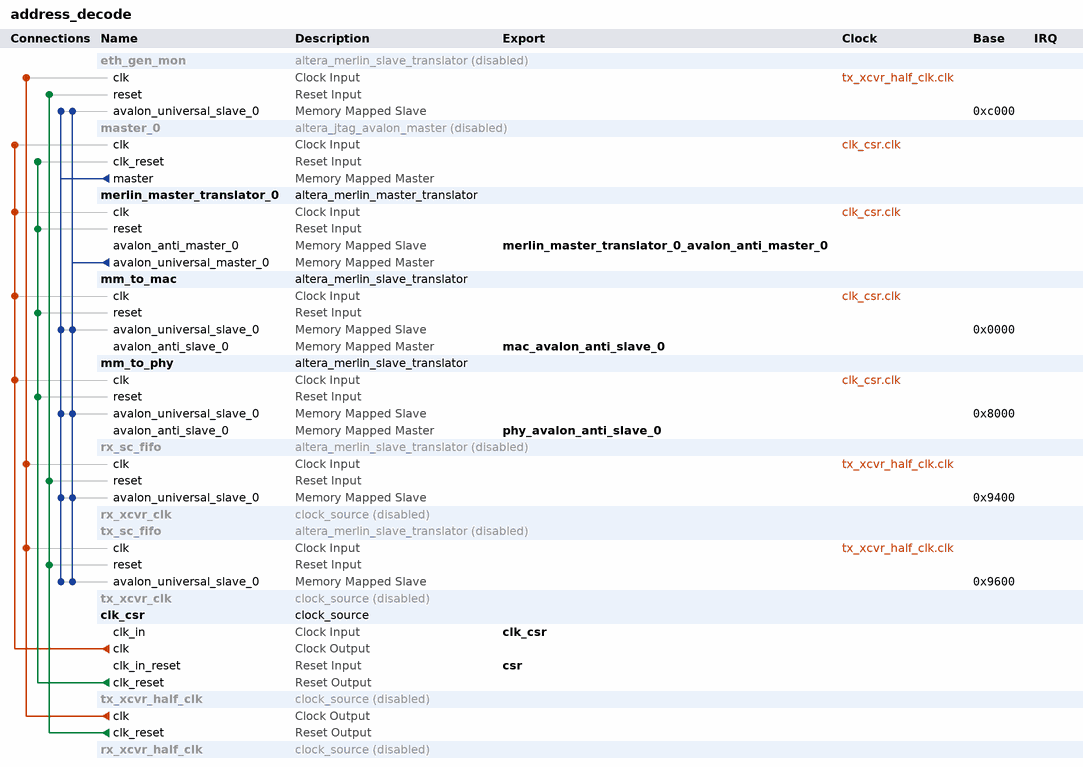
[diagram p0: system contents]
# Platform Designer (Qsys) system address_decode, Stratix 10 1SG280LU2F50E1VG
# Parameters at their usual value, and those the tool derives, are not listed.
package require -exact qsys 1.0
create_system address_decode
set_project_property DEVICE_FAMILY {Stratix 10}
set_project_property DEVICE 1SG280LU2F50E1VG

add_component eth_gen_mon ip/address_decode/address_decode_eth_gen_mon.ip altera_merlin_slave_translator eth_gen_mon 16.1
set_instance_property eth_gen_mon ENABLED false

add_component master_0 {} altera_jtag_avalon_master master_0 16.1
set_instance_property master_0 ENABLED false

add_component merlin_master_translator_0 ip/address_decode/address_decode_merlin_master_translator_0.ip altera_merlin_master_translator merlin_master_translator_0 16.1

add_component mm_to_mac ip/address_decode/address_decode_mm_to_mac.ip altera_merlin_slave_translator mm_to_mac 16.1

add_component mm_to_phy ip/address_decode/address_decode_mm_to_phy.ip altera_merlin_slave_translator mm_to_phy 16.1

add_component rx_sc_fifo ip/address_decode/address_decode_rx_sc_fifo.ip altera_merlin_slave_translator rx_sc_fifo 16.1
set_instance_property rx_sc_fifo ENABLED false

add_component rx_xcvr_clk ip/address_decode/address_decode_rx_xcvr_clk.ip clock_source rx_xcvr_clk 
set_instance_property rx_xcvr_clk ENABLED false

add_component tx_sc_fifo ip/address_decode/address_decode_tx_sc_fifo.ip altera_merlin_slave_translator tx_sc_fifo 16.1
set_instance_property tx_sc_fifo ENABLED false

add_component tx_xcvr_clk ip/address_decode/address_decode_tx_xcvr_clk.ip clock_source tx_xcvr_clk 
set_instance_property tx_xcvr_clk ENABLED false

add_component clk_csr ip/address_decode/address_decode_clk_csr.ip clock_source clk_csr 

add_component tx_xcvr_half_clk ip/address_decode/address_decode_tx_xcvr_half_clk.ip clock_source tx_xcvr_half_clk 
set_instance_property tx_xcvr_half_clk ENABLED false

add_component rx_xcvr_half_clk ip/address_decode/address_decode_rx_xcvr_half_clk.ip clock_source rx_xcvr_half_clk 
set_instance_property rx_xcvr_half_clk ENABLED false

# connections
add_connection clk_csr.clk master_0.clk clock
add_connection clk_csr.clk merlin_master_translator_0.clk clock
add_connection clk_csr.clk mm_to_mac.clk clock
add_connection clk_csr.clk mm_to_phy.clk clock
add_connection tx_xcvr_half_clk.clk eth_gen_mon.clk clock
add_connection tx_xcvr_half_clk.clk rx_sc_fifo.clk clock
add_connection tx_xcvr_half_clk.clk tx_sc_fifo.clk clock
add_connection clk_csr.clk_reset master_0.clk_reset reset
add_connection clk_csr.clk_reset merlin_master_translator_0.reset reset
add_connection clk_csr.clk_reset mm_to_mac.reset reset
add_connection clk_csr.clk_reset mm_to_phy.reset reset
add_connection tx_xcvr_half_clk.clk_reset eth_gen_mon.reset reset
add_connection tx_xcvr_half_clk.clk_reset rx_sc_fifo.reset reset
add_connection tx_xcvr_half_clk.clk_reset tx_sc_fifo.reset reset
add_connection master_0.master eth_gen_mon.avalon_universal_slave_0 avalon
set_connection_parameter_value master_0.master/eth_gen_mon.avalon_universal_slave_0 baseAddress 0xc000
set_connection_parameter_value master_0.master/eth_gen_mon.avalon_universal_slave_0 burstAdapterImplementation GENERIC_CONVERTER
set_connection_parameter_value master_0.master/eth_gen_mon.avalon_universal_slave_0 clockCrossingAdapter AUTO
set_connection_parameter_value master_0.master/eth_gen_mon.avalon_universal_slave_0 enableEccProtection FALSE
set_connection_parameter_value master_0.master/eth_gen_mon.avalon_universal_slave_0 insertDefaultSlave FALSE
set_connection_parameter_value master_0.master/eth_gen_mon.avalon_universal_slave_0 interconnectResetSource DEFAULT
set_connection_parameter_value master_0.master/eth_gen_mon.avalon_universal_slave_0 interconnectType STANDARD
set_connection_parameter_value master_0.master/eth_gen_mon.avalon_universal_slave_0 maximumAdditionalLatency 0
add_connection master_0.master mm_to_mac.avalon_universal_slave_0 avalon
set_connection_parameter_value master_0.master/mm_to_mac.avalon_universal_slave_0 baseAddress 0x0000
set_connection_parameter_value master_0.master/mm_to_mac.avalon_universal_slave_0 burstAdapterImplementation GENERIC_CONVERTER
set_connection_parameter_value master_0.master/mm_to_mac.avalon_universal_slave_0 clockCrossingAdapter AUTO
set_connection_parameter_value master_0.master/mm_to_mac.avalon_universal_slave_0 enableEccProtection FALSE
set_connection_parameter_value master_0.master/mm_to_mac.avalon_universal_slave_0 insertDefaultSlave FALSE
set_connection_parameter_value master_0.master/mm_to_mac.avalon_universal_slave_0 interconnectResetSource DEFAULT
set_connection_parameter_value master_0.master/mm_to_mac.avalon_universal_slave_0 interconnectType STANDARD
set_connection_parameter_value master_0.master/mm_to_mac.avalon_universal_slave_0 maximumAdditionalLatency 0
add_connection master_0.master mm_to_phy.avalon_universal_slave_0 avalon
set_connection_parameter_value master_0.master/mm_to_phy.avalon_universal_slave_0 baseAddress 0x8000
set_connection_parameter_value master_0.master/mm_to_phy.avalon_universal_slave_0 burstAdapterImplementation GENERIC_CONVERTER
set_connection_parameter_value master_0.master/mm_to_phy.avalon_universal_slave_0 clockCrossingAdapter AUTO
set_connection_parameter_value master_0.master/mm_to_phy.avalon_universal_slave_0 enableEccProtection FALSE
set_connection_parameter_value master_0.master/mm_to_phy.avalon_universal_slave_0 insertDefaultSlave FALSE
set_connection_parameter_value master_0.master/mm_to_phy.avalon_universal_slave_0 interconnectResetSource DEFAULT
set_connection_parameter_value master_0.master/mm_to_phy.avalon_universal_slave_0 interconnectType STANDARD
set_connection_parameter_value master_0.master/mm_to_phy.avalon_universal_slave_0 maximumAdditionalLatency 0
add_connection master_0.master rx_sc_fifo.avalon_universal_slave_0 avalon
set_connection_parameter_value master_0.master/rx_sc_fifo.avalon_universal_slave_0 baseAddress 0x9400
set_connection_parameter_value master_0.master/rx_sc_fifo.avalon_universal_slave_0 burstAdapterImplementation GENERIC_CONVERTER
set_connection_parameter_value master_0.master/rx_sc_fifo.avalon_universal_slave_0 clockCrossingAdapter AUTO
set_connection_parameter_value master_0.master/rx_sc_fifo.avalon_universal_slave_0 enableEccProtection FALSE
set_connection_parameter_value master_0.master/rx_sc_fifo.avalon_universal_slave_0 insertDefaultSlave FALSE
set_connection_parameter_value master_0.master/rx_sc_fifo.avalon_universal_slave_0 interconnectResetSource DEFAULT
set_connection_parameter_value master_0.master/rx_sc_fifo.avalon_universal_slave_0 interconnectType STANDARD
set_connection_parameter_value master_0.master/rx_sc_fifo.avalon_universal_slave_0 maximumAdditionalLatency 0
add_connection master_0.master tx_sc_fifo.avalon_universal_slave_0 avalon
set_connection_parameter_value master_0.master/tx_sc_fifo.avalon_universal_slave_0 baseAddress 0x9600
set_connection_parameter_value master_0.master/tx_sc_fifo.avalon_universal_slave_0 burstAdapterImplementation GENERIC_CONVERTER
set_connection_parameter_value master_0.master/tx_sc_fifo.avalon_universal_slave_0 clockCrossingAdapter AUTO
set_connection_parameter_value master_0.master/tx_sc_fifo.avalon_universal_slave_0 enableEccProtection FALSE
set_connection_parameter_value master_0.master/tx_sc_fifo.avalon_universal_slave_0 insertDefaultSlave FALSE
set_connection_parameter_value master_0.master/tx_sc_fifo.avalon_universal_slave_0 interconnectResetSource DEFAULT
set_connection_parameter_value master_0.master/tx_sc_fifo.avalon_universal_slave_0 interconnectType STANDARD
set_connection_parameter_value master_0.master/tx_sc_fifo.avalon_universal_slave_0 maximumAdditionalLatency 0
add_connection merlin_master_translator_0.avalon_universal_master_0 eth_gen_mon.avalon_universal_slave_0 avalon
set_connection_parameter_value merlin_master_translator_0.avalon_universal_master_0/eth_gen_mon.avalon_universal_slave_0 baseAddress 0xc000
set_connection_parameter_value merlin_master_translator_0.avalon_universal_master_0/eth_gen_mon.avalon_universal_slave_0 burstAdapterImplementation GENERIC_CONVERTER
set_connection_parameter_value merlin_master_translator_0.avalon_universal_master_0/eth_gen_mon.avalon_universal_slave_0 clockCrossingAdapter AUTO
set_connection_parameter_value merlin_master_translator_0.avalon_universal_master_0/eth_gen_mon.avalon_universal_slave_0 enableEccProtection FALSE
set_connection_parameter_value merlin_master_translator_0.avalon_universal_master_0/eth_gen_mon.avalon_universal_slave_0 insertDefaultSlave FALSE
set_connection_parameter_value merlin_master_translator_0.avalon_universal_master_0/eth_gen_mon.avalon_universal_slave_0 interconnectResetSource DEFAULT
set_connection_parameter_value merlin_master_translator_0.avalon_universal_master_0/eth_gen_mon.avalon_universal_slave_0 interconnectType STANDARD
set_connection_parameter_value merlin_master_translator_0.avalon_universal_master_0/eth_gen_mon.avalon_universal_slave_0 maximumAdditionalLatency 0
add_connection merlin_master_translator_0.avalon_universal_master_0 mm_to_mac.avalon_universal_slave_0 avalon
set_connection_parameter_value merlin_master_translator_0.avalon_universal_master_0/mm_to_mac.avalon_universal_slave_0 baseAddress 0x0000
set_connection_parameter_value merlin_master_translator_0.avalon_universal_master_0/mm_to_mac.avalon_universal_slave_0 burstAdapterImplementation GENERIC_CONVERTER
set_connection_parameter_value merlin_master_translator_0.avalon_universal_master_0/mm_to_mac.avalon_universal_slave_0 clockCrossingAdapter AUTO
set_connection_parameter_value merlin_master_translator_0.avalon_universal_master_0/mm_to_mac.avalon_universal_slave_0 enableEccProtection FALSE
set_connection_parameter_value merlin_master_translator_0.avalon_universal_master_0/mm_to_mac.avalon_universal_slave_0 insertDefaultSlave FALSE
set_connection_parameter_value merlin_master_translator_0.avalon_universal_master_0/mm_to_mac.avalon_universal_slave_0 interconnectResetSource DEFAULT
set_connection_parameter_value merlin_master_translator_0.avalon_universal_master_0/mm_to_mac.avalon_universal_slave_0 interconnectType STANDARD
set_connection_parameter_value merlin_master_translator_0.avalon_universal_master_0/mm_to_mac.avalon_universal_slave_0 maximumAdditionalLatency 0
add_connection merlin_master_translator_0.avalon_universal_master_0 mm_to_phy.avalon_universal_slave_0 avalon
set_connection_parameter_value merlin_master_translator_0.avalon_universal_master_0/mm_to_phy.avalon_universal_slave_0 baseAddress 0x8000
set_connection_parameter_value merlin_master_translator_0.avalon_universal_master_0/mm_to_phy.avalon_universal_slave_0 burstAdapterImplementation GENERIC_CONVERTER
set_connection_parameter_value merlin_master_translator_0.avalon_universal_master_0/mm_to_phy.avalon_universal_slave_0 clockCrossingAdapter AUTO
set_connection_parameter_value merlin_master_translator_0.avalon_universal_master_0/mm_to_phy.avalon_universal_slave_0 enableEccProtection FALSE
set_connection_parameter_value merlin_master_translator_0.avalon_universal_master_0/mm_to_phy.avalon_universal_slave_0 insertDefaultSlave FALSE
set_connection_parameter_value merlin_master_translator_0.avalon_universal_master_0/mm_to_phy.avalon_universal_slave_0 interconnectResetSource DEFAULT
set_connection_parameter_value merlin_master_translator_0.avalon_universal_master_0/mm_to_phy.avalon_universal_slave_0 interconnectType STANDARD
set_connection_parameter_value merlin_master_translator_0.avalon_universal_master_0/mm_to_phy.avalon_universal_slave_0 maximumAdditionalLatency 0
add_connection merlin_master_translator_0.avalon_universal_master_0 rx_sc_fifo.avalon_universal_slave_0 avalon
set_connection_parameter_value merlin_master_translator_0.avalon_universal_master_0/rx_sc_fifo.avalon_universal_slave_0 baseAddress 0x9400
set_connection_parameter_value merlin_master_translator_0.avalon_universal_master_0/rx_sc_fifo.avalon_universal_slave_0 burstAdapterImplementation GENERIC_CONVERTER
set_connection_parameter_value merlin_master_translator_0.avalon_universal_master_0/rx_sc_fifo.avalon_universal_slave_0 clockCrossingAdapter AUTO
set_connection_parameter_value merlin_master_translator_0.avalon_universal_master_0/rx_sc_fifo.avalon_universal_slave_0 enableEccProtection FALSE
set_connection_parameter_value merlin_master_translator_0.avalon_universal_master_0/rx_sc_fifo.avalon_universal_slave_0 insertDefaultSlave FALSE
set_connection_parameter_value merlin_master_translator_0.avalon_universal_master_0/rx_sc_fifo.avalon_universal_slave_0 interconnectResetSource DEFAULT
set_connection_parameter_value merlin_master_translator_0.avalon_universal_master_0/rx_sc_fifo.avalon_universal_slave_0 interconnectType STANDARD
set_connection_parameter_value merlin_master_translator_0.avalon_universal_master_0/rx_sc_fifo.avalon_universal_slave_0 maximumAdditionalLatency 0
add_connection merlin_master_translator_0.avalon_universal_master_0 tx_sc_fifo.avalon_universal_slave_0 avalon
set_connection_parameter_value merlin_master_translator_0.avalon_universal_master_0/tx_sc_fifo.avalon_universal_slave_0 baseAddress 0x9600
set_connection_parameter_value merlin_master_translator_0.avalon_universal_master_0/tx_sc_fifo.avalon_universal_slave_0 burstAdapterImplementation GENERIC_CONVERTER
set_connection_parameter_value merlin_master_translator_0.avalon_universal_master_0/tx_sc_fifo.avalon_universal_slave_0 clockCrossingAdapter AUTO
set_connection_parameter_value merlin_master_translator_0.avalon_universal_master_0/tx_sc_fifo.avalon_universal_slave_0 enableEccProtection FALSE
set_connection_parameter_value merlin_master_translator_0.avalon_universal_master_0/tx_sc_fifo.avalon_universal_slave_0 insertDefaultSlave FALSE
set_connection_parameter_value merlin_master_translator_0.avalon_universal_master_0/tx_sc_fifo.avalon_universal_slave_0 interconnectResetSource DEFAULT
set_connection_parameter_value merlin_master_translator_0.avalon_universal_master_0/tx_sc_fifo.avalon_universal_slave_0 interconnectType STANDARD
set_connection_parameter_value merlin_master_translator_0.avalon_universal_master_0/tx_sc_fifo.avalon_universal_slave_0 maximumAdditionalLatency 0

# exported interfaces
add_interface clk_csr clock sink
set_interface_property clk_csr EXPORT_OF clk_csr.clk_in
add_interface csr reset sink
set_interface_property csr EXPORT_OF clk_csr.clk_in_reset
add_interface mac_avalon_anti_slave_0 avalon master
set_interface_property mac_avalon_anti_slave_0 EXPORT_OF mm_to_mac.avalon_anti_slave_0
add_interface merlin_master_translator_0_avalon_anti_master_0 avalon slave
set_interface_property merlin_master_translator_0_avalon_anti_master_0 EXPORT_OF merlin_master_translator_0.avalon_anti_master_0
add_interface phy_avalon_anti_slave_0 avalon master
set_interface_property phy_avalon_anti_slave_0 EXPORT_OF mm_to_phy.avalon_anti_slave_0

set_interconnect_requirement {$system} qsys_mm.clockCrossingAdapter HANDSHAKE
set_interconnect_requirement {$system} qsys_mm.insertDefaultSlave FALSE
set_interconnect_requirement {$system} qsys_mm.maxAdditionalLatency 1

save_system address_decode.qsys
